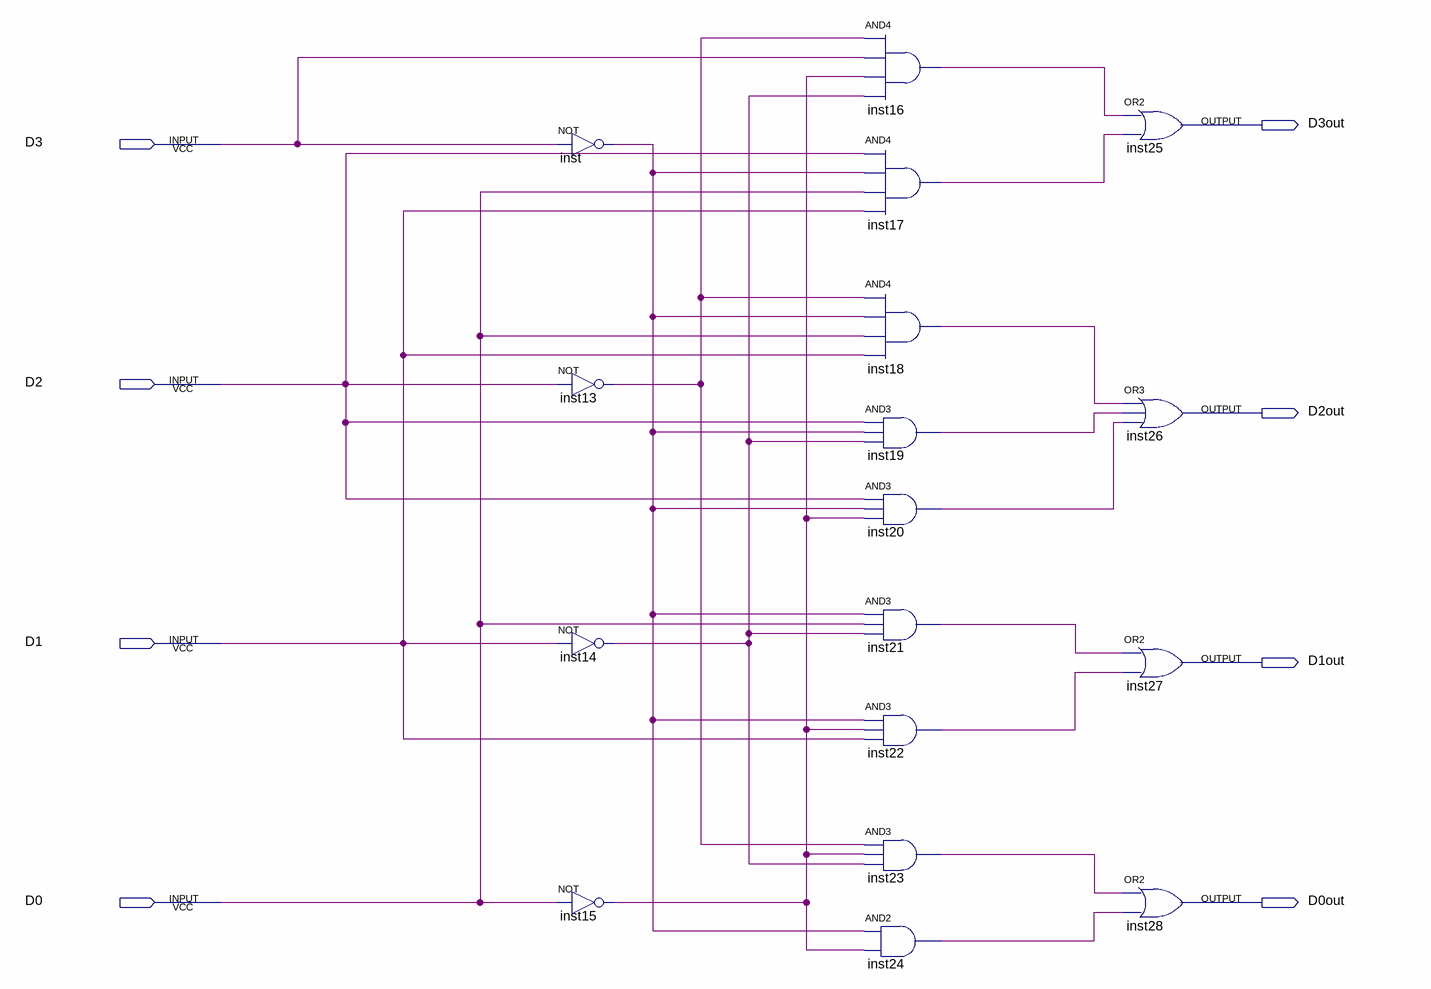
[diagram p0: schematic sheet]
// Quartus schematic kmapcounter.bdf as structural Verilog: 17 symbols, 8 pins
module kmapcounter (
  input  D3,
  input  D2,
  input  D1,
  input  D0,
  output D3out,
  output D2out,
  output D1out,
  output D0out
);

  wire inst13_out, inst14_out, inst15_out, inst16_out, inst17_out, inst18_out, inst19_out, inst20_out,
       inst21_out, inst22_out, inst23_out, inst24_out, inst_out;

  not inst (inst_out, D3);
  not inst13 (inst13_out, D2);
  not inst14 (inst14_out, D1);
  not inst15 (inst15_out, D0);
  and inst16 (inst16_out, inst13_out, D3, inst15_out, inst14_out);
  and inst17 (inst17_out, D2, inst_out, D0, D1);
  and inst18 (inst18_out, inst13_out, inst_out, D0, D1);
  and inst19 (inst19_out, D2, inst_out, inst14_out);
  and inst20 (inst20_out, D2, inst_out, inst15_out);
  and inst21 (inst21_out, inst_out, D0, inst14_out);
  and inst22 (inst22_out, inst_out, inst15_out, D1);
  and inst23 (inst23_out, inst13_out, inst15_out, inst14_out);
  and inst24 (inst24_out, inst_out, inst15_out);
  or inst25 (D3out, inst16_out, inst17_out);
  or inst26 (D2out, inst18_out, inst19_out, inst20_out);
  or inst27 (D1out, inst21_out, inst22_out);
  or inst28 (D0out, inst23_out, inst24_out);
endmodule
